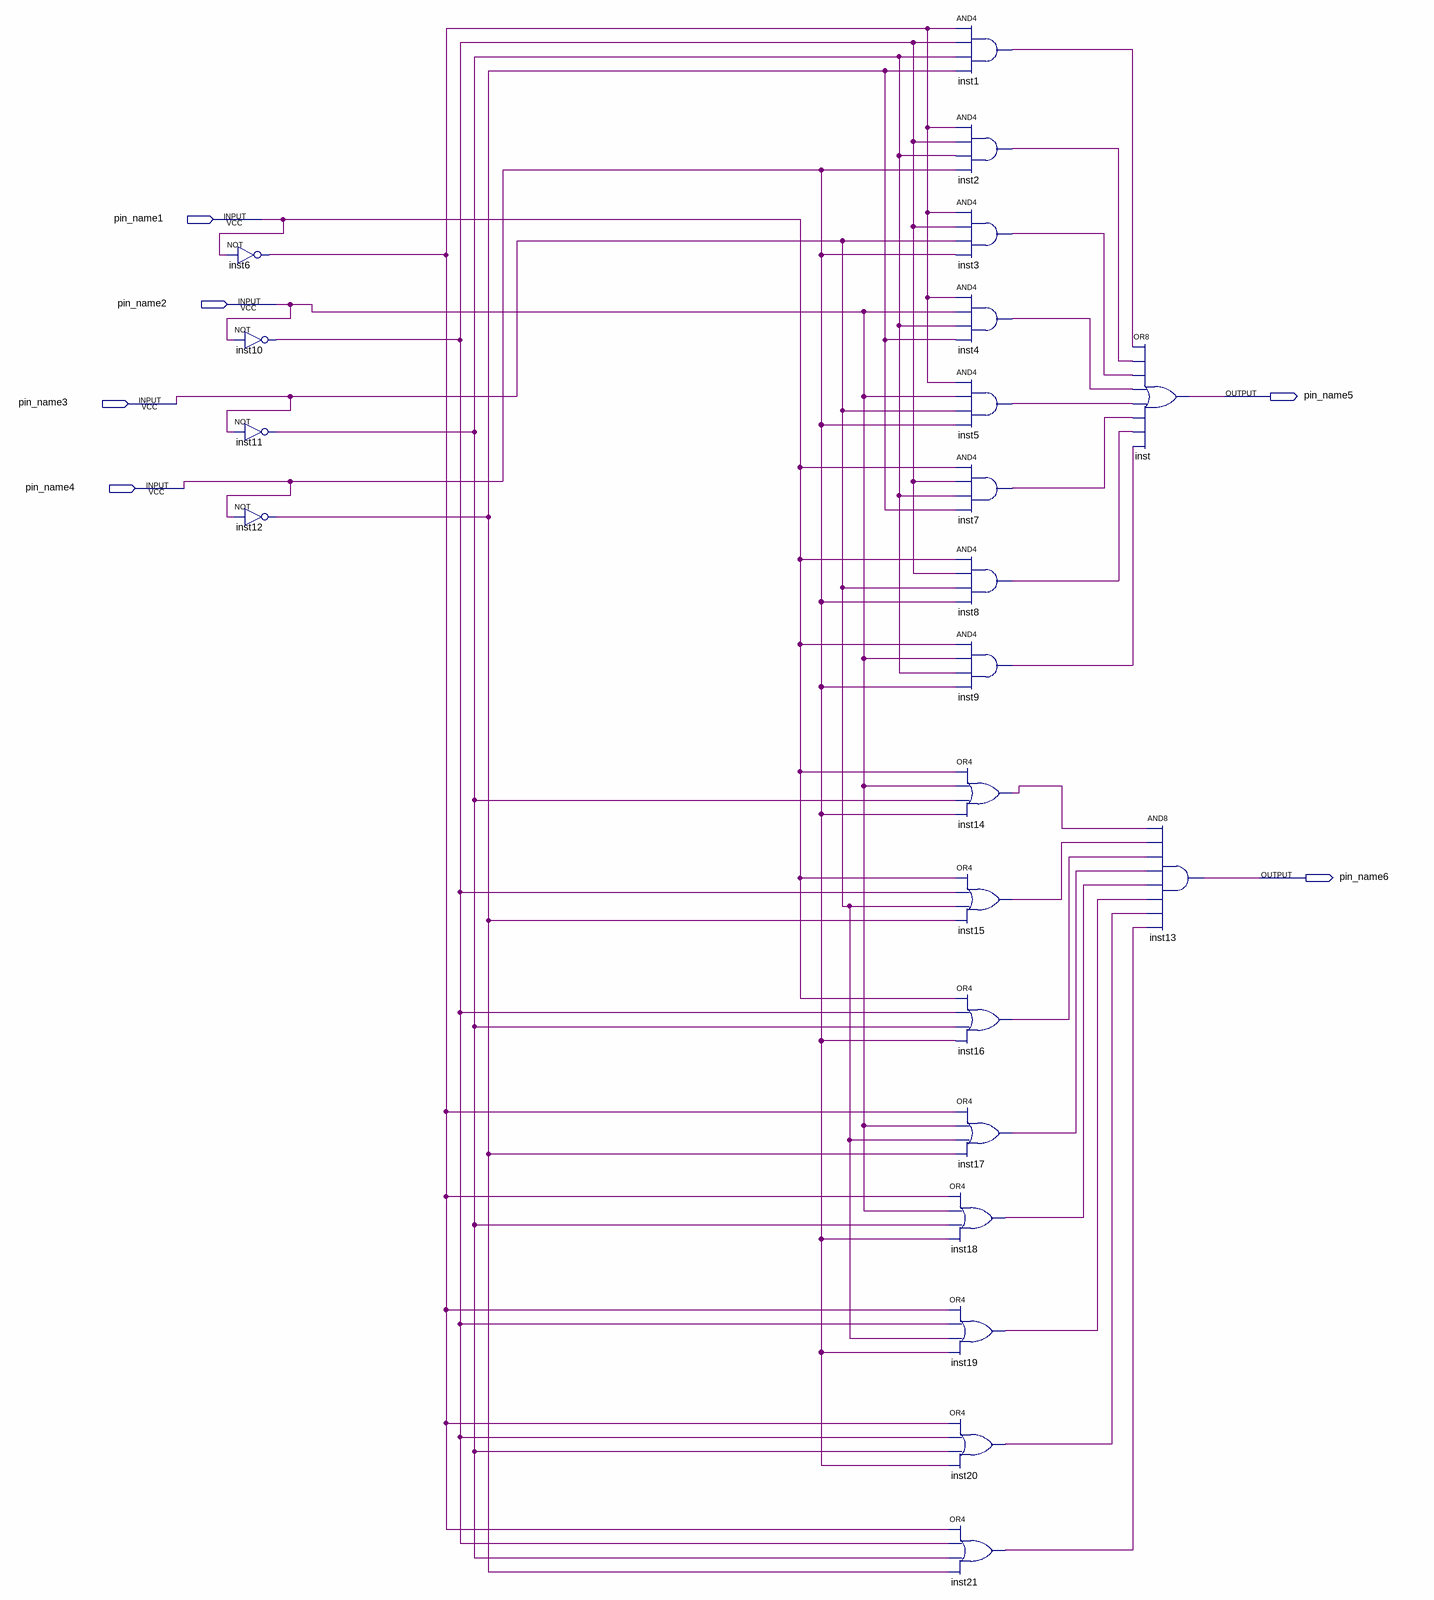
[diagram p0: schematic sheet]
// Quartus schematic lab2.bdf as structural Verilog: 22 symbols, 6 pins
module lab2 (
  input  pin_name1,
  input  pin_name2,
  input  pin_name3,
  input  pin_name4,
  output pin_name5,
  output pin_name6
);

  wire inst1_out, inst2_out, inst3_out, inst4_out, inst5_out, inst6_out, inst7_out, inst8_out, inst9_out,
       inst10_out, inst11_out, inst12_out, inst14_out, inst15_out, inst16_out, inst17_out, inst18_out,
       inst19_out, inst20_out, inst21_out;

  not inst6 (inst6_out, pin_name1);
  not inst10 (inst10_out, pin_name2);
  not inst11 (inst11_out, pin_name3);
  not inst12 (inst12_out, pin_name4);
  and inst1 (inst1_out, inst6_out, inst10_out, inst11_out, inst12_out);
  and inst2 (inst2_out, inst6_out, inst10_out, inst11_out, pin_name4);
  and inst3 (inst3_out, inst6_out, inst10_out, pin_name3, pin_name4);
  and inst4 (inst4_out, inst6_out, pin_name2, inst11_out, inst12_out);
  and inst5 (inst5_out, inst6_out, pin_name2, pin_name3, pin_name4);
  and inst7 (inst7_out, pin_name1, inst10_out, inst11_out, inst12_out);
  and inst8 (inst8_out, pin_name1, inst10_out, pin_name3, pin_name4);
  and inst9 (inst9_out, pin_name1, pin_name2, inst11_out, pin_name4);
  or inst14 (inst14_out, pin_name1, pin_name2, inst11_out, pin_name4);
  or inst15 (inst15_out, pin_name1, inst10_out, pin_name3, inst12_out);
  or inst16 (inst16_out, pin_name1, inst10_out, inst11_out, pin_name4);
  or inst17 (inst17_out, inst6_out, pin_name2, pin_name3, inst12_out);
  or inst18 (inst18_out, inst6_out, pin_name2, inst11_out, pin_name4);
  or inst19 (inst19_out, inst6_out, inst10_out, pin_name3, pin_name4);
  or inst20 (inst20_out, inst6_out, inst10_out, inst11_out, pin_name4);
  or inst21 (inst21_out, inst6_out, inst10_out, inst11_out, inst12_out);
  or inst (pin_name5, inst1_out, inst2_out, inst3_out, inst4_out, inst5_out, inst7_out, inst8_out, inst9_out);
  and inst13 (pin_name6, inst14_out, inst15_out, inst16_out, inst17_out, inst18_out, inst19_out, inst20_out, inst21_out);
endmodule
